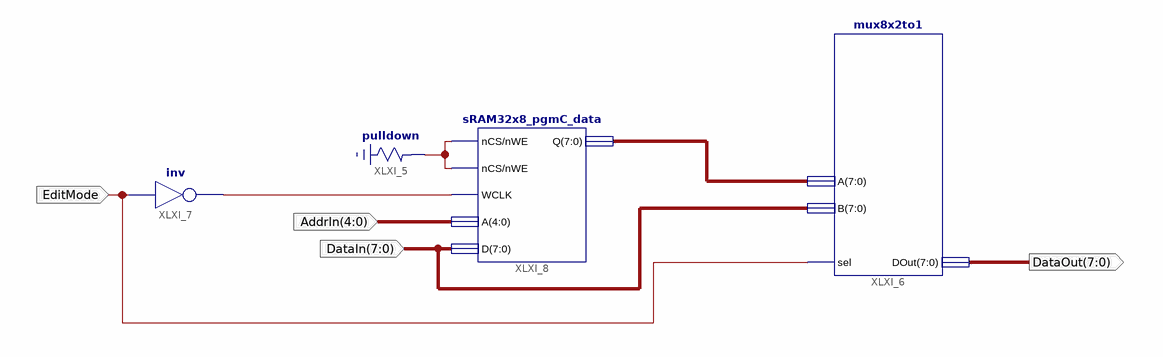
[diagram p0: schematic sheet 1]
// Xilinx ISE schematic DataMem.sch (spartan3e) as structural Verilog: 4 symbols, 4 ports
module DataMem (
  input  [4:0] AddrIn,
  input  [7:0] DataIn,
  input  EditMode,
  output [7:0] DataOut
);

  wire XLXN_2, XLXN_3;
  wire [7:0] XLXN_4;

  \pulldown  XLXI_5 (.O(XLXN_2));
  mux8x2to1 XLXI_6 (.A(XLXN_4), .B(DataIn), .sel(EditMode), .DOut(DataOut));
  not XLXI_7 (XLXN_3, EditMode);
  sRAM32x8_pgmC_data XLXI_8 (.nCS(XLXN_2), .nWE(XLXN_2), .WCLK(XLXN_3), .A(AddrIn), .D(DataIn), .Q(XLXN_4));
endmodule
